# EAGLE design buck (EAGLE 6.3)
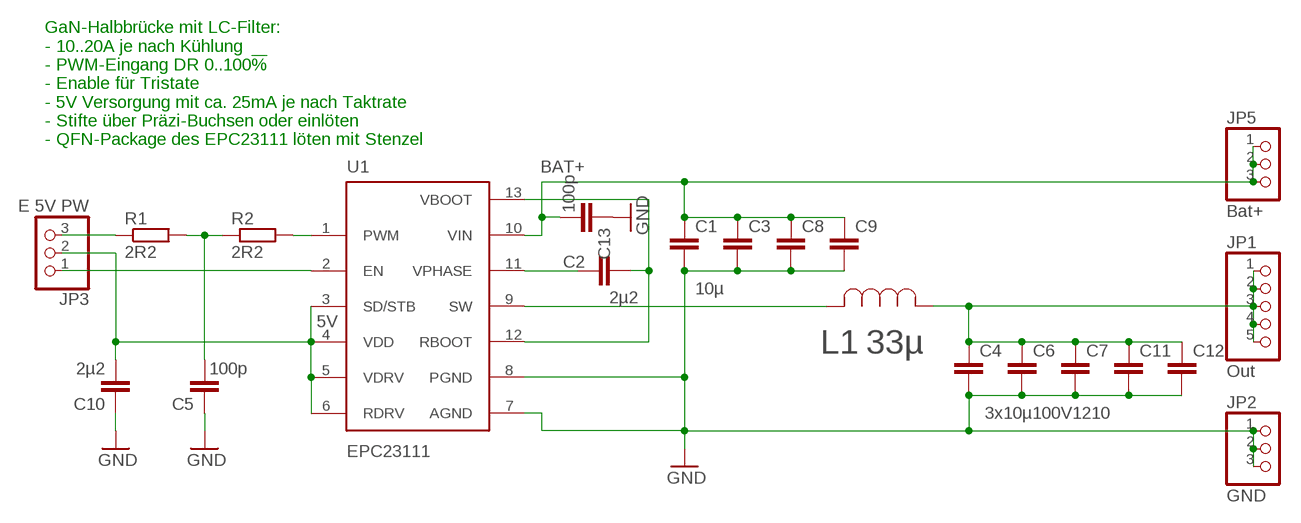
[diagram p0: schematic, sheet 1]

## Parts
C1  10µ  C-EUC1210K  [C1210K]
C2  2µ2  C-EUC0603K  [C0603K]
C3  10µ100V1210  C-EUC1210K  [C1210K]
C4  10µ  C-EUC1210K  [C1210K]
C5  100p  C-EUC0603K  [C0603K]
C6  3x10µ100V1210  C-EUC1210K  [C1210K]
C7  10µ100V1210  C-EUC1210K  [C1210K]
C8  10µ100V1210  C-EUC1210K  [C1210K]
C9  10µ100V1210  C-EUC1210K  [C1210K]
C10  2µ2  C-EUC0603K  [C0603K]
C11  10µ100V1210  C-EUC1210K  [C1210K]
C12  10µ100V1210  C-EUC1210K  [C1210K]
C13  100p  C-EUC1206K  [C1206K]
JP1  Out  PINHD-1X5  [1X05]
JP2  GND  PINHD-1X3  [1X03]
JP3  E 5V PW  PINHD-1X3  [1X03]
JP5  Bat+  PINHD-1X3  [1X03]
L1  33µ  PA4349.333ANLTIND_PA4349.333ANLT_PUL-M  [IND_PA4349.333ANLT_PUL-M]
R1  2R2  R-EU_R0603  [R0603]
R2  2R2  R-EU_R0603  [R0603]
U1  EPC23111  [EPC23111_QFN13_EPC_LP]

## Nets
5V: C10.2 JP3.2 U1.3(SD/STB) U1.4(VDD) U1.5(VDRV) U1.6(RDRV)
BAT+: C1.1 C3.1 C8.1 C9.1 C13.2 JP5.1 JP5.2 JP5.3 U1.10(VIN)
GND: C1.2 C3.2 C4.2 C5.1 C6.2 C7.2 C8.2 C9.2 C10.1 C11.2 C12.2 C13.1 JP2.1 JP2.2 JP2.3 U1.7(AGND) U1.8(PGND)
N$2: C5.2 R1.2 R2.1
N$3: R2.2 U1.1(PWM)
N$5: JP3.1 U1.2(EN)
N$6: JP3.3 R1.1
N$7: C2.1 U1.12(RBOOT) U1.13(VBOOT)
N$8: C2.2 U1.11(VPHASE)
SW: L1.2 U1.9(SW)
UOUT: C4.1 C6.1 C7.1 C11.1 C12.1 JP1.1 JP1.2 JP1.3 JP1.4 JP1.5 L1.1

## Notes on the sheet
- GaN-Halbbrücke mit LC-Filter:
  - 10..20A je nach Kühlung
  - PWM-Eingang DR 0..100!%
  - Enable für Tristate
  - 5V Versorgung mit ca. 25mA je nach Taktrate
  - Stifte über Präzi-Buchsen oder einlöten
  - QFN-Package des EPC23111 löten mit Stenzel

## Library data of the parts
C1-C13 = rcl:C-EU: CAPACITOR, European symbol
JP1 = pinhead:PINHD-1X5: PIN HEADER
JP2 JP3 JP5 = pinhead:PINHD-1X3: PIN HEADER
L1 = MYLIB:PA4349.333ANLT; COPYRIGHT: Copyright (C) 2021 Ultra Librarian. All rights reserved.; DIGI-KEY_PART_NUMBER_1: 553-4049-2-ND; DIGI-KEY_PART_NUMBER_2: 553-4049-1-ND; DIGI-KEY_PART_NUMBER_3: 553-4049-6-ND; MANUFACTURER_PART_NUMBER: PA4349.333ANLT; MFR_NAME: Pulse Electronics Corporation
R1 R2 = rcl:R-EU_: RESISTOR, European symbol
U1 = EPC23111_Eagle63:EPC23111: EPC23111 ePower Stage IC, 100 V, 20 A, single PWM input.

## Board
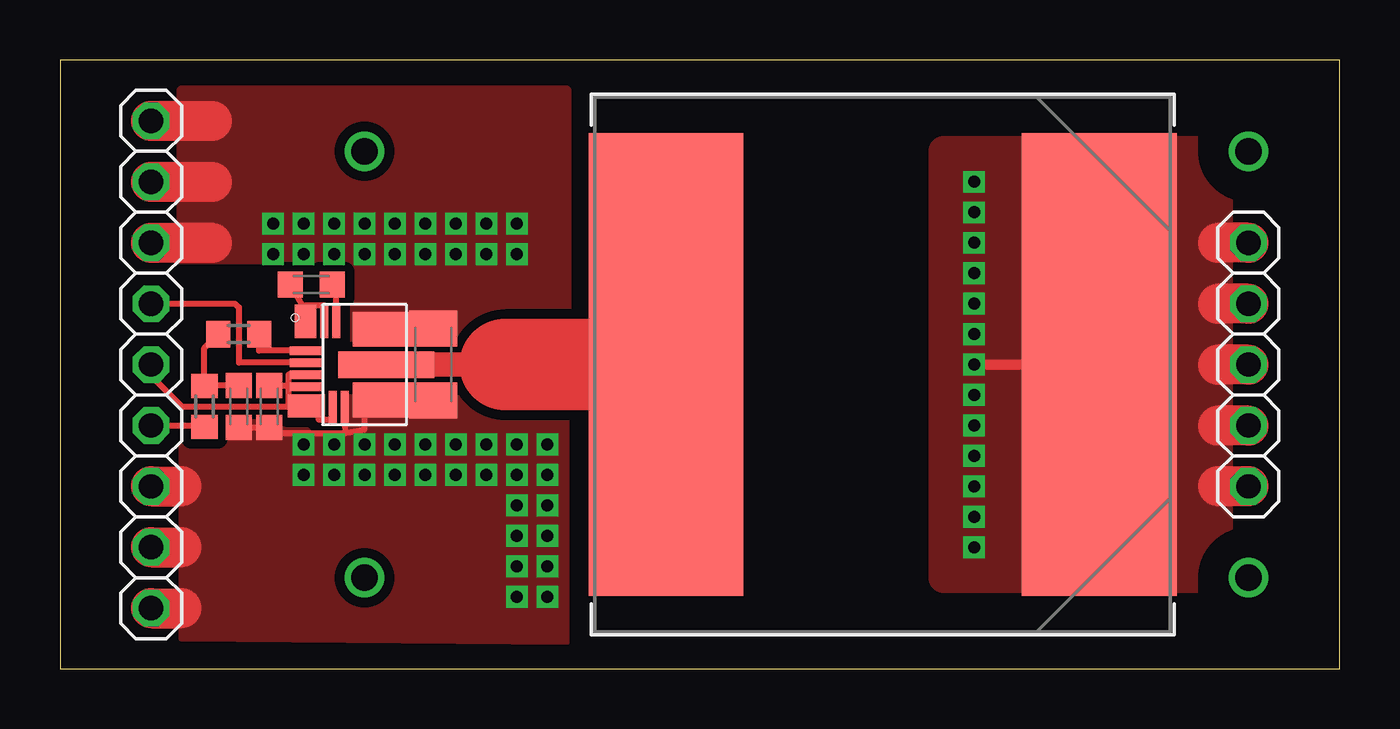
[diagram p1: board, top side]
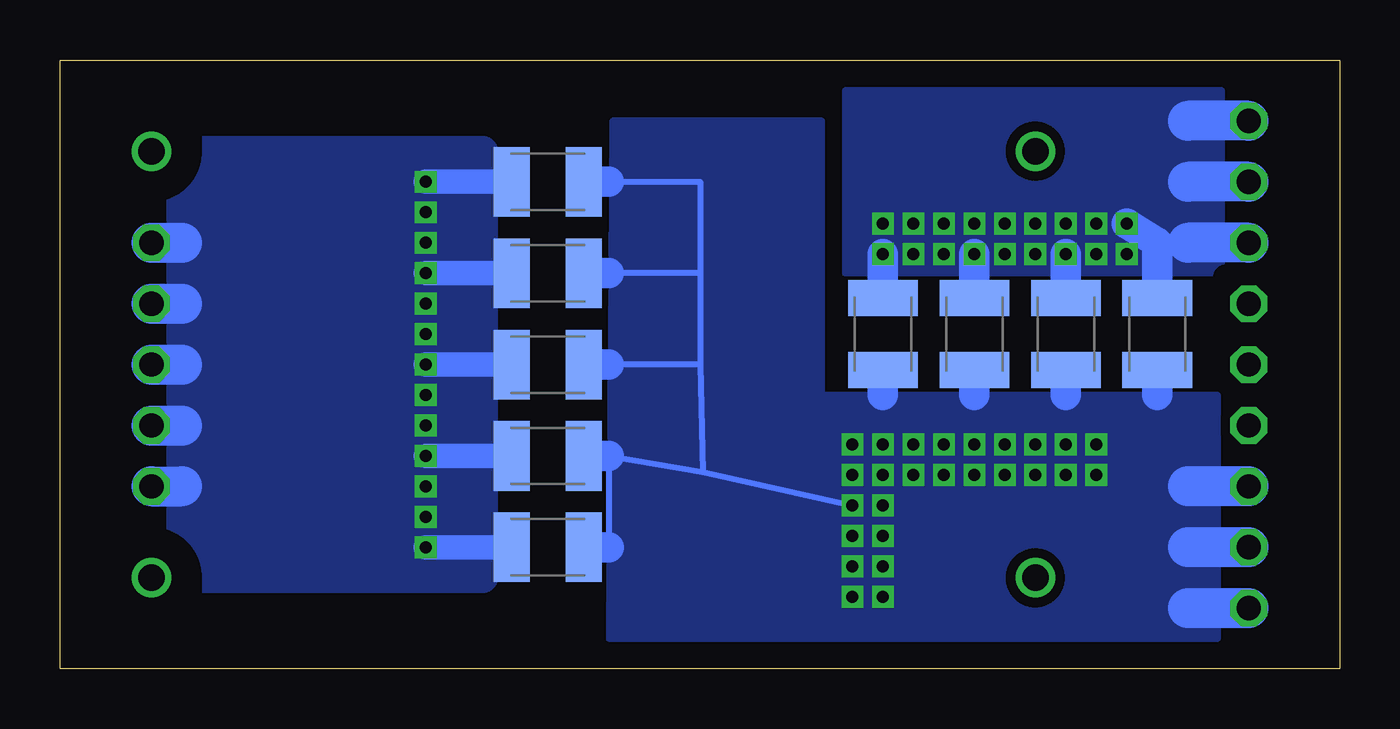
[diagram p2: board, bottom side, seen from below]

Size 53.33 x 25.39 mm. Coordinates in mm from the lower left corner, seen from the top.
Outline: 53.33,25.39 0,25.39 0,0 53.33,0 53.33,25.39
Copper layers (1*16): Top 0.035mm / dielectric 1.5mm / Bottom 0.035mm
Design rules "default *": minimum track width 10mil, minimum drill 19mil, track to track 6mil, track to pad 6mil, pad to pad 6mil, via to via 6mil, smd to smd 6mil, copper to edge 40mil, drill to drill 8mil, minimum pad ring 10mil, minimum via ring 8mil, stop-mask expansion 4mil, vias tented up to drill 0mil, thermal gap 40mil
tRestrict: 1 lines
bRestrict: 1 lines

### Footprints (pad centres in the part's own frame; a part is rotated, then mirrored left to right if it is on the bottom)
C1210K = smd 1.5 x 2.9: 1 -1.5,0; 2 1.5,0
C0603K = smd 1.05 x 1.08: 1 -0.875,0; 2 0.875,0
C1206K = smd 1.5 x 2: 1 -1.5,0; 2 1.5,0
1X05 = drill 1.016 octagon: 1 -5.08,0; 2 -2.54,0; 3 0,0; 4 2.54,0; 5 5.08,0
1X03 = drill 1.016 octagon: 1 -2.54,0; 2 0,0; 3 2.54,0
IND_PA4349.333ANLT_PUL-M = smd 6.452 x 19.304: 1 -9.03,0; 2 9.03,0
R0603 = smd 1 x 1.1: 1 -0.85,0; 2 0.85,0
EPC23111_QFN13_EPC_LP = smd 1.4 x 0.348: 1 -2.425,0.575; 2 -2.425,0.075; 3 -2.425,-0.425; 4 -2.425,-0.925 | smd 1.55 x 0.948: 5 -2.425,-1.725 | smd 0.348 x 1.4: 6 -1.325,-1.8; 7 -0.825,-1.8; 11 -1.175,1.8; 12 -1.675,1.8 | smd 3.398 x 1.45: 8 1.2,-1.475 | smd 4 x 1.1: 9 0.9,0 | smd 3.4 x 1.45: 10 1.2,1.475 | smd 0.898 x 1.4: 13 -2.45,1.8

### Placement (x,y rotation side)
C1  19.04,13.96 270 bottom
C2  10.46,16.02 0 top
C3  7.61,13.96 270 bottom
C4  33.01,12.69 0 bottom
C5  7.45,10.94 90 top
C6  33.01,16.5 0 bottom
C7  33.01,8.88 0 bottom
C8  15.23,13.96 270 bottom
C9  11.42,13.96 270 bottom
C10  8.72,10.94 90 top
C11  33.01,5.07 0 bottom
C12  33.01,20.31 0 bottom
C13  15.54,12.69 90 top
JP1  49.52,12.69 90 top
JP2  3.8,5.07 90 top
JP3  3.8,12.69 270 top
JP5  3.8,20.31 90 top
L1  34.28,12.69 180 top
R1  6.02,10.94 90 top
R2  7.45,13.96 0 top
U1  12.69,12.69 0 top

### Tracks (layer width: path | path; a pad name or v marks a point on that pad's centre or on a via)
5V
  Top 0.254: U1.5 10.6,10.81 | JP3.2 3.8,12.21 5.07,10.94 9.51,10.94 | 9.51,10.94 10.39,10.94 U1.5 | C10.2 9.51,11.82 | 9.51,11.82 10.36,11.82 U1.4 9.51,11.77 9.51,10.94 | U1.3 9.51,12.27 9.51,11.82 | U1.6 11.34,10.89 11.34,10.39 10.78,10.39 10.78,10.71 10.26,10.71 U1.5
BAT+  (via drill 0.5)
  Top 1.676: JP5.2 6.34,20.31 | JP5.1 6.34,17.77 | JP5.3 6.34,22.85
  Bottom 1.27: C8.1 v15.23,17.29 | C1.1 v19.04,17.29 | C9.1 v11.42,17.29 | C3.1 7.61,17.77 v8.88,18.56
  Bottom 1.676: JP5.2 6.34,20.31 | JP5.1 6.34,17.77 | JP5.3 6.34,22.85
  other vias: 8.88,17.29 10.15,17.29 12.69,17.29 13.96,17.29 15.23,18.56 13.96,18.56 11.42,18.56 10.15,18.56 16.5,17.29 17.77,17.29 17.77,18.56 16.5,18.56 12.69,18.56 19.04,18.56
  pour Top (isolate 0.406, no thermals): 5.07,24.12 21.1,24.12 21.1,12.69 5.07,12.69
  pour Bottom (isolate 0.406, no thermals): 4.91,24.12 20.62,24.12 20.62,16.5 4.91,16.5
GND  (via drill 0.5)
  Top 0.254: 11.89,9.83 8.72,9.83 C10.1 C5.1 | 11.89,9.83 12.69,9.99 12.69,10.63 U1.8 13.8,11.1 | U1.7 11.86,10.18 11.89,9.83
  Top 1.676: JP2.3 5.07,7.61 | JP2.2 5.07,5.07 | JP2.1 5.07,2.53
  Bottom 0.254: 30.47,5.07 30.47,8.88 26.55,8.21 | 26.55,8.21 v20.31,6.82 | C12.2 26.66,20.31 26.66,16.5 | 26.66,16.5 30.47,16.5 | 26.66,16.5 26.66,12.69 | 26.66,12.69 30.47,12.69 | 26.66,12.69 26.55,8.21
  Bottom 1.27: C1.2 19.04,11.42 | C8.2 15.23,11.42 | C9.2 11.42,11.42 | C3.2 7.61,11.42 | C12.2 30.47,20.31 | C6.2 30.47,16.5 | C4.2 30.47,12.69 | C7.2 30.47,8.88 | C11.2 30.47,5.07
  Bottom 1.676: JP2.2 6.34,5.07 | JP2.1 6.34,2.53 | JP2.3 6.34,7.61
  other vias: 13.96,8.09 15.23,8.09 12.69,8.09 19.04,8.09 16.5,8.09 17.77,8.09 12.69,9.36 13.96,9.36 15.23,9.36 16.5,9.36 17.77,9.36 19.04,9.36 20.31,9.36 20.31,8.09 19.04,6.82 19.04,5.55 19.04,4.28 19.04,3.01 20.31,5.55 20.31,4.28 20.31,3.01 10.15,8.09 11.42,8.09 10.15,9.36 11.42,9.36
  pour Bottom (isolate 0.406, no thermals): 30.31,22.85 30.47,1.26 5.07,1.26 5.07,11.42 21.58,11.42 21.58,22.85
  pour Top (isolate 0.406, no thermals): 21.1,1.1 5.07,1.26 5.07,11.42 21.1,11.26
N$1  (via drill 1.1)
  other vias: 12.69,3.8
N$2
  Top 0.254: C5.2 6.04,11.82 R1.2 6.02,13.38 R2.1
N$3
  Top 0.254: U1.1 8.3,13.27 R2.2
N$4  (via drill 1.1)
  other vias: 12.69,21.58
N$5
  Top 0.254: JP3.1 7.29,15.23 7.45,15.07 7.45,12.77 U1.2
N$6
  Top 0.254: JP3.3 5.6,10.15 R1.1
N$7
  Top 0.254: C2.1 10.24,14.93 U1.13 10.24,15.15 11.02,15.15 11.02,14.49 U1.12
N$8
  Top 0.254: U1.11 11.51,15.66 C2.2
N$9  (via drill 1.1)
  other vias: 49.52,21.58
N$10  (via drill 1.1)
  other vias: 49.52,3.8
SW
  Top 1.016: 18.56,12.69 U1.9
  Top 3.81: L1.2 18.56,12.69
UOUT  (via drill 0.5)
  Top 0.406: v38.09,12.69 L1.1
  Top 1.676: JP1.5 48.25,17.77 | JP1.4 48.25,15.23 | JP1.3 48.25,12.69 | JP1.2 48.25,10.15 | JP1.1 48.25,7.61
  Bottom 1.016: C4.1 v38.09,12.69 | C12.1 v38.09,20.31 | C6.1 v38.09,16.5 | C7.1 v38.09,8.88 | C11.1 v38.09,5.07
  Bottom 1.676: JP1.5 48.25,17.77 | JP1.4 48.25,15.23 | JP1.3 48.25,12.69 | JP1.2 48.25,10.15 | JP1.1 48.25,7.61
  other vias: 38.09,17.77 38.09,15.23 38.09,7.61 38.09,10.15 38.09,11.42 38.09,6.34 38.09,19.04 38.09,13.96
  pour Top (isolate 1.27, no thermals): 48.25,21.58 48.25,3.8 36.82,3.8 36.82,21.58
  pour Bottom (isolate 1.27, no thermals): 35.71,21.58 48.25,21.58 48.25,3.8 35.71,3.8